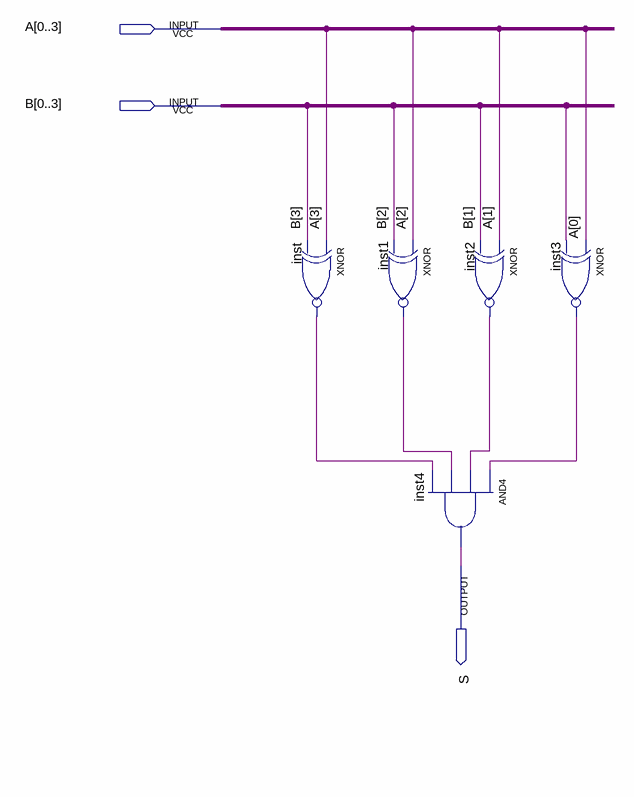
[diagram p0: schematic sheet]
// Quartus schematic Igual.bdf as structural Verilog: 5 symbols, 3 pins
module Igual (
  input  [0:3] A,
  input  [0:3] B,
  output S
);

  wire inst1_out, inst2_out, inst3_out, inst_out, undriven;

  xnor inst (inst_out, A[3], B[3]);
  xnor inst1 (inst1_out, A[2], B[2]);
  xnor inst2 (inst2_out, A[1], B[1]);
  and inst4 (S, inst3_out, inst2_out, inst1_out, inst_out);
  xnor inst3 (inst3_out, A[0], undriven);
endmodule
